# EAGLE design sapflow_v4 (EAGLE 9.5.2)
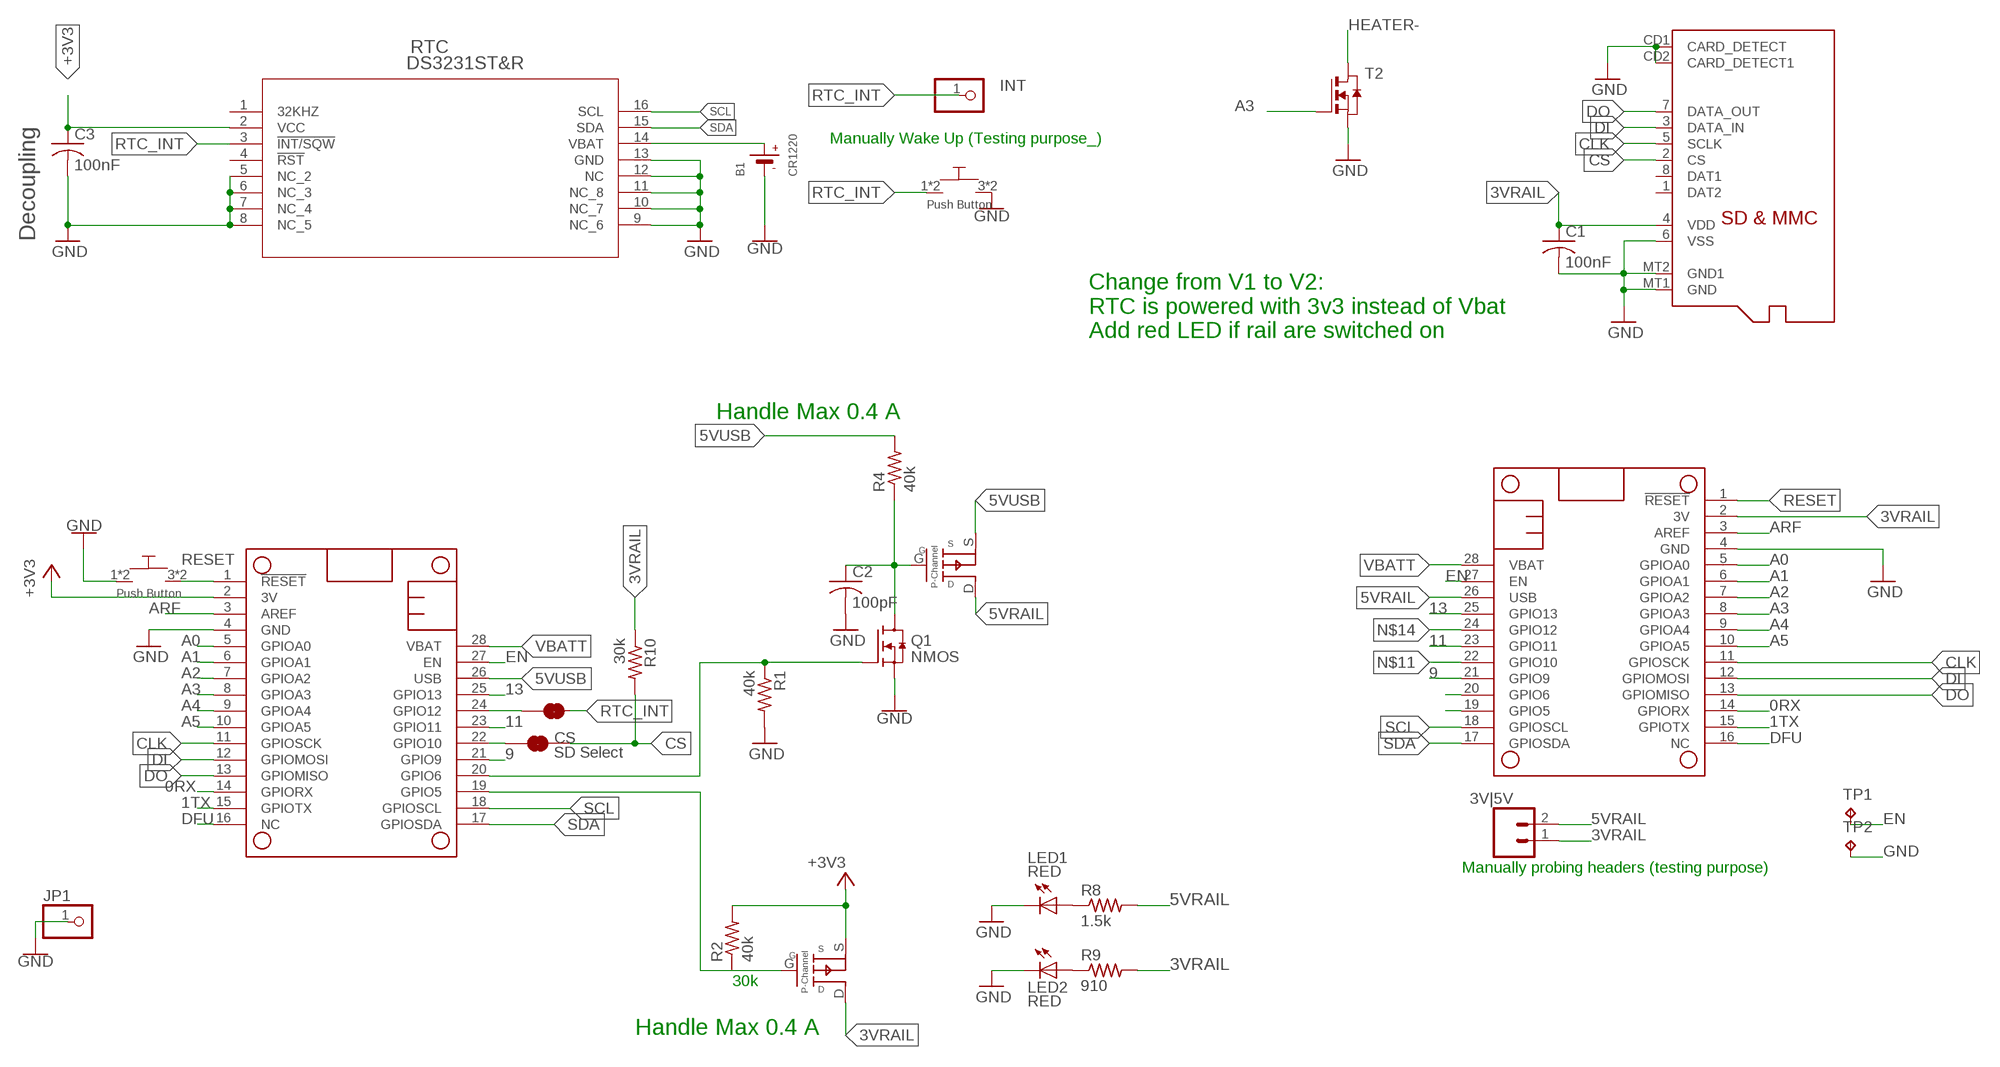
[diagram p0: schematic, sheet 1, part 1 of 2]
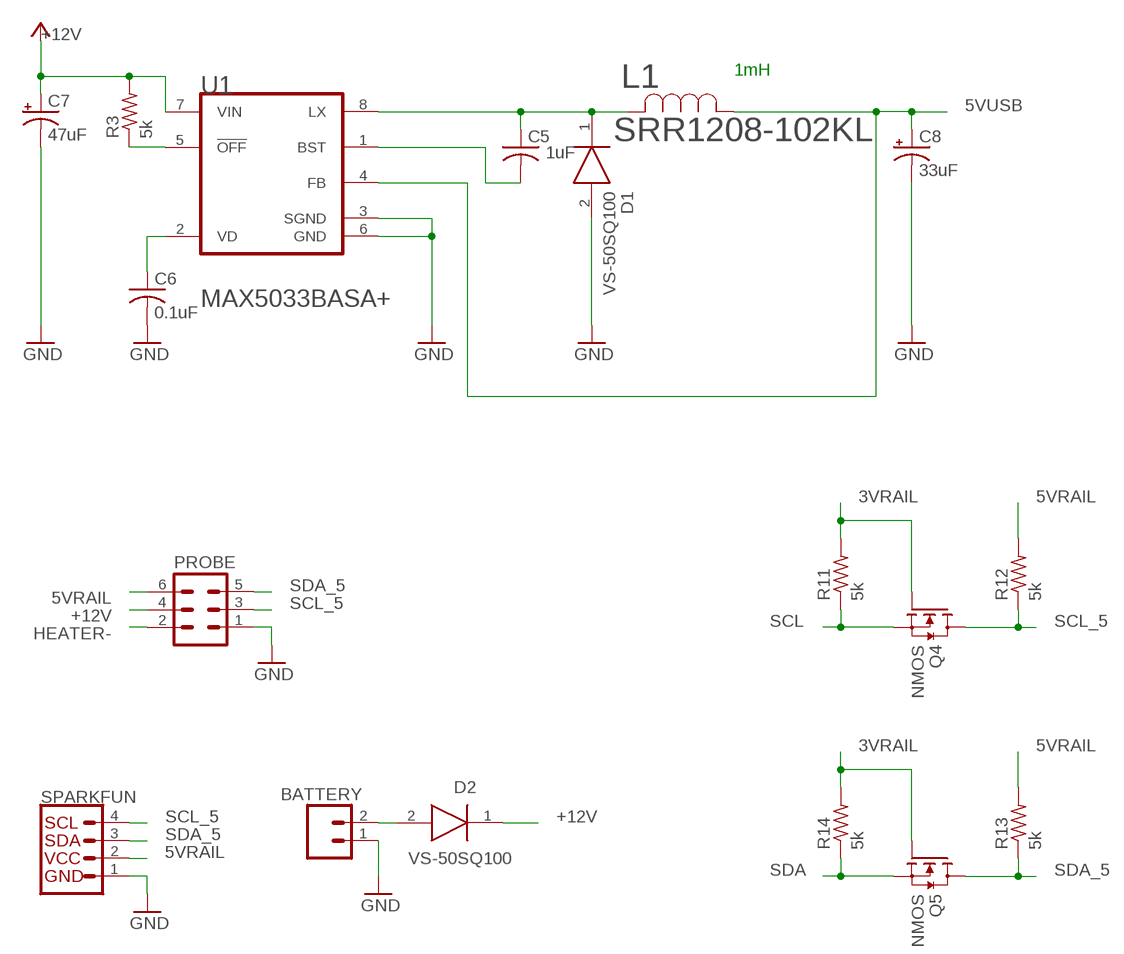
[diagram p1: schematic, sheet 1, part 2 of 2]

## Parts
3V|5V  CONN_021X02_NO_SILK  [1X02_NO_SILK]
B1  CR1220  BATTERYCR1220_SMT  [CR1220]
BATTERY  HIGHV-OUT  CONN_021X02_NO_SILK  [1X02_NO_SILK]
C1  100nF  C-USC0805  [C0805]
C2  100pF  C-USC0805  [C0805]
C3  100nF  C-USC0805  [C0805]
C5  1uF  C-USC0805  [C0805]
C6  0.1uF  C-USC0805  [C0805]
C7  47uF  CPOL-USD/7343-31R  [D/7343-31R]
C8  33uF  CPOL-USD/7343-31R  [D/7343-31R]
CS  SD Select  JUMPER-SMT_2_NC_TRACE_SILK  [SMT-JUMPER_2_NC_TRACE_SILK]
D1  VS-50SQ100  [DIOAD1405W86L465D235]
D2  VS-50SQ100  [DIOAD1405W86L465D235]
INT  PINHD-1X1CB  [1X01-CLEANBIG]
JP1  PINHD-1X1CB  [1X01-CLEANBIG]
L1  SRR1208-102KL  [IND_BOURNS_SRR1208]
LED1  RED  LEDCHIPLED_0805  [CHIPLED_0805]
LED2  RED  LEDCHIPLED_0805  [CHIPLED_0805]
MICROSD  MICROSD  [MICROSD]
MS1  FEATHERWING  [FEATHERWING]
MS2  FEATHERWING  [FEATHERWING]
PMOS1  SSM3J3228R  [SOT-23-3]
PMOS2  SSM3J3228R  [SOT-23-3]
PROBE  MA03-2  [MA03-2]
Q1  NMOS  [SOT23-S]
Q4  NMOS  [SOT23-S]
Q5  NMOS  [SOT23-S]
R1  40k  R-US_R0805  [R0805]
R2  40k  R-US_R0805  [R0805]
R3  5k  R-US_R0805  [R0805]
R4  40k  R-US_R0805  [R0805]
R8  1.5k  R-US_R0805  [R0805]
R9  910  R-US_R0805  [R0805]
R10  30k  R-US_R0805  [R0805]
R11  5k  R-US_R0805  [R0805]
R12  5k  R-US_R0805  [R0805]
R13  5k  R-US_R0805  [R0805]
R14  5k  R-US_R0805  [R0805]
RTC  DS3231ST&R  [21-0042B_16]
RTC_INT  JUMPER-SMT_2_NC_TRACE_SILK  [SMT-JUMPER_2_NC_TRACE_SILK]
SPARKFUN  I2C_STANDARD_NO_SILK  [1X04_NO_SILK]
T2  NMOSSOT223  [SOT223]
TP1  TPTP16R  [TP16R]
TP2  TPTP16R  [TP16R]
U1  MAXIM_MAX5033BASA+MAXIM_MAX5033BASA+_0_1  [MAXIM_MAX5033BASA+_1]
U$1  PUSH_BUTTON  [PUSHBUTTON_SMD]
U$2  PUSH_BUTTON  [PUSHBUTTON_SMD]

## Nets
0RX: MS1.14(GPIORX) MS2.14(GPIORX)
1TX: MS1.15(GPIOTX) MS2.15(GPIOTX)
3VRAIL: 3V|5V.1 C1.1 MICROSD.4(VDD) MS1.2(3V) PMOS2.D Q4.1(G) Q5.1(G) R9.2 R10.1 R11.2 R14.2
5VRAIL: 3V|5V.2 MS1.26(USB) PMOS1.D PROBE.6 R8.2 R12.2 R13.2 SPARKFUN.2(VCC)
5VUSB: C8.+ L1.1 MS2.26(USB) PMOS1.S R4.2 U1.4(FB)
9: MS1.21(GPIO9) MS2.21(GPIO9)
11: MS1.23(GPIO11) MS2.23(GPIO11)
13: MS1.25(GPIO13) MS2.25(GPIO13)
+3V3: C3.1 MS2.2(3V) PMOS2.S R2.2 RTC.2(VCC)
+12V: C7.+ D2.1(K) PROBE.4 R3.2 U1.7(VIN) ; supply symbol labelled 15V
A0: MS1.5(GPIOA0) MS2.5(GPIOA0)
A1: MS1.6(GPIOA1) MS2.6(GPIOA1)
A2: MS1.7(GPIOA2) MS2.7(GPIOA2)
A3: MS1.8(GPIOA3) MS2.8(GPIOA3) T2.1(G)
A4: MS1.9(GPIOA4) MS2.9(GPIOA4)
A5: MS1.10(GPIOA5) MS2.10(GPIOA5)
ARF: MS1.3(AREF) MS2.3(AREF)
CLK: MICROSD.5(SCLK) MS1.11(GPIOSCK) MS2.11(GPIOSCK)
CS: CS.2 MICROSD.2(CS) R10.2
DFU: MS1.16(NC) MS2.16(NC)
DI: MICROSD.3(DATA_IN) MS1.12(GPIOMOSI) MS2.12(GPIOMOSI)
DO: MICROSD.7(DATA_OUT) MS1.13(GPIOMISO) MS2.13(GPIOMISO)
EN: MS1.27(EN) MS2.27(EN) TP1.TP
GND [GND]: B1.- BATTERY.1 C1.2 C2.2 C3.2 C6.2 C7.- C8.- D1.2(A) JP1.1 LED1.C LED2.C MICROSD.6(VSS) MICROSD.CD1(CARD_DETECT) MICROSD.CD2(CARD_DETECT1) MICROSD.MT1(GND) MICROSD.MT2(GND1) MS1.4(GND) MS2.4(GND) PROBE.1 Q1.2(S) R1.2 RTC.5(NC_2) RTC.6(NC_3) RTC.7(NC_4) RTC.8(NC_5) RTC.9(NC_6) RTC.10(NC_7) RTC.11(NC_8) RTC.12(NC) RTC.13(GND) SPARKFUN.1(GND) T2.3(S) TP2.TP U1.3(SGND) U1.6(GND) U$1.1 U$1.2 U$2.3 U$2.4
HEATER-: PROBE.2 T2.2(D) T2.4(D)
N$1: MS2.20(GPIO6) Q1.1(G) R1.1
N$2: B1.+$1(+) RTC.14(VBAT)
N$3: MS2.19(GPIO5) PMOS2.G R2.1
N$4: BATTERY.2 D2.2(A)
N$6: C6.1 U1.2(VD)
N$7: MS1.20(GPIO6)
N$8: MS1.19(GPIO5)
N$9: R3.1 U1.5(!OFF!)
N$10: C2.1 PMOS1.G Q1.3(D) R4.1
N$11: CS.1 MS1.22(GPIO10) MS2.22(GPIO10)
N$12: LED1.A R8.1
N$13: LED2.A R9.1
N$14: MS1.24(GPIO12) MS2.24(GPIO12) RTC_INT.1
N$16: C5.2 U1.1(BST)
N$17: C5.1 D1.1(K) L1.2 U1.8(LX)
RESET: MS1.1(!RESET) MS2.1(!RESET) U$1.3 U$1.4
RTC_INT: INT.1 RTC.3(!INT/SQW) RTC_INT.2 U$2.1 U$2.2
SCL: MS1.18(GPIOSCL) MS2.18(GPIOSCL) Q4.2(S) R11.1 RTC.16(SCL)
SCL_5: PROBE.3 Q4.3(D) R12.1 SPARKFUN.4(SCL)
SDA: MS1.17(GPIOSDA) MS2.17(GPIOSDA) Q5.2(S) R14.1 RTC.15(SDA)
SDA_5: PROBE.5 Q5.3(D) R13.1 SPARKFUN.3(SDA)
VBATT: MS1.28(VBAT) MS2.28(VBAT)
Unconnected: MICROSD.1(DAT2) MICROSD.8(DAT1) RTC.1(32KHZ) RTC.4(!RST)

## Notes on the sheet
- 1mH
- Manually Wake Up (Testing purpose_)
- Decoupling
- Change from V1 to V2:
  RTC is powered with 3v3 instead of Vbat
  Add red LED if rail are switched on
- Handle Max 0.4 A
- Manually probing headers (testing purpose)
- 30k
- Handle Max 0.4 A

## Library data of the parts
3V|5V BATTERY = SparkFun-Connectors:CONN_02: Multi connection point. Often used as Generic Header-pin footprint for 0.1 inch spaced/style header connections On any of the 0.1 inch spaced packages, you can populate with these: Break Away Headers - Straight <https://www.sparkfun.com/products/116> (PRT-00116) Break Away Male Headers - Right Angle <https://www.sparkfun.com/products/553> (PRT-00553) Female Headers <https://www.sparkfun.com/products/115> (PRT-00115) Break Away Headers - Machine Pin <https://www.sparkfun.com/products/117> (PRT-00117) Break Away Female Headers - Swiss Machine Pin <https://www.sparkfun.com/products/743> (PRT-00743) For SCREWTERMINALS and SPRING TERMINALS visit here: Screw Terimnals on SparkFun.com <https://www.sparkfun.com/search/results?term=Screw+Terminals> (5mm/3.5mm/2.54mm spacing) This device is also useful as a general connection point to wire up your design to another part of your project. Our various solder wires solder well into these plated through hole pads. Hook-Up Wire - Assortment (Stranded, 22 AWG) <https://www.sparkfun.com/products/11375> (PRT-11375) Hook-Up Wire - Assortment (Solid Core, 22 AWG) <https://www.sparkfun.com/products/11367> (PRT-11367) View the entire wire category on our website here <https://www.sparkfun.com/categories/141> Special notes: Molex polarized connector foot print use with: PRT-08233 with associated crimp pins and housings. 2.54_SCREWTERM for use with PRT-10571. 3.5mm Screw Terminal footprints for PRT-08084 5mm Screw Terminal footprints for use with PRT-08432
B1 = microbuilder:BATTERY: CR1220 SMT - Digikey: 3001K-ND CD2032 BAT-HLD-001 - Digikey: BAT-HLD-001-ND
C1 C3 = adafruit:C-US: CAPACITOR, American symbol
C2 = resistor:C-US: CAPACITOR, American symbol
C5 C6 = rcl:C-US: CAPACITOR, American symbol; SPICEPREFIX: C
C7 C8 = rcl:CPOL-US: POLARIZED CAPACITOR, American symbol; SPICEPREFIX: C
CS RTC_INT = SparkFun-Jumpers:JUMPER-SMT_2_NC_TRACE: Normally closed trace jumper This jumper has a trace between two pads so it's normally closed (NC). Use a razor knife to open the connection. For best results follow the IPC guidelines for cutting traces: Cutout at least 0.063 mm (0.005 in). Remove all loose material to clean up the cut area. Seal the cut with an approved epoxy. Reapply solder to reclose the connection.
D1 D2 = VS-50SQ100:VS-50SQ100: VS-50SQ100, Schottky Diode, 5A max, 100V, 2-Pin, DO-204AR Source: Datasheet <http://docs-emea.rs-online.com/webdocs/0791/0900766b8079106c.pdf>; ALLIED_NUMBER: 70078786; ALLIED_PRICE-STOCK: http://www.alliedelec.com/vishay-pcs-vs-50sq100/70078786/; DESCRIPTION: VS-50SQ100, Schottky Diode, 5A max, 100V, 2-Pin, DO-204AR; HEIGHT: mm; MANUFACTURER_NAME: Vishay; MANUFACTURER_PART_NUMBER: VS-50SQ100; MOUSER_PART_NUMBER: 844-50SQ100; MOUSER_PRICE-STOCK: https://www.mouser.com/Search/Refine.aspx?Keyword=844-50SQ100; RS_PART_NUMBER: 5446041; RS_PRICE-STOCK: https://uk.rs-online.com/web/p/products/5446041
INT JP1 = adafruit:PINHD-1X1: Pin header 1x1 for 0.1" spacing With round pins
L1 = SRR1208-102KL:SRR1208-102KL; BUILT_BY: EMA_UL_Team; MANUFACTURER_PART_NUMBER: SRR1208-102KL; VENDOR: Bourns Electronics
LED1 LED2 = adafruit:LED: LED OSRAM: - CHIPLED LG R971, LG N971, LY N971, LG Q971, LY Q971, LO R971, LY R971 LH N974, LH R974 LS Q976, LO Q976, LY Q976 LO Q996 - Hyper CHIPLED LW Q18S LB Q993, LB Q99A, LB R99A - SideLED LS A670, LO A670, LY A670, LG A670, LP A670 LB A673, LV A673, LT A673, LW A673 LH A674 LY A675 LS A676, LA A676, LO A676, LY A676, LW A676 LS A679, LY A679, LG A679 - Hyper Micro SIDELED® LS Y876, LA Y876, LO Y876, LY Y876 LT Y87S - SmartLED LW L88C, LW L88S LB L89C, LB L89S, LG L890 LS L89K, LO L89K, LY L89K LS L896, LA L896, LO L896, LY L896 - TOPLED LS T670, LO T670, LY T670, LG T670, LP T670 LSG T670, LSP T670, LSY T670, LOP T670, LYG T670 LG T671, LOG T671, LSG T671 LB T673, LV T673, LT T673, LW T673 LH T674 LS T676, LA T676, LO T676, LY T676, LB T676, LH T676, LSB T676, LW T676 LB T67C, LV T67C, LT T67C, LS T67K, LO T67K, LY T67K, LW E67C LS E67B, LA E67B, LO E67B, LY E67B, LB E67C, LV E67C, LT E67C LW T67C LS T679, LY T679, LG T679 LS T770, LO T770, LY T770, LG T770, LP T770 LB T773, LV T773, LT T773, LW T773 LH T774 LS E675, LA E675, LY E675, LS T675 LS T776, LA T776, LO T776, LY T776, LB T776 LHGB T686 LT T68C, LB T68C - Hyper Mini TOPLED® LB M676 - Mini TOPLED Santana® LG M470 LS M47K, LO M47K, LY M47K Source: http://www.osram.convergy.de/
MICROSD = adafruit:MICROSD: Micro-SD / Transflash card holder with SPI pinout For the 3M # 2908-05WB-MG and/or 4UCON #19656 push-push type
MS1 = powerboard:FEATHERWING
MS2 = adafruit:FEATHERWING
PMOS1 PMOS2 = M0_Power:SSM3J3228R: P-Channel MOSFET, SOT-23-3 SMD Package
PROBE = better_header:MA03-2: PIN HEADER; OC_FARNELL: unknown; OC_NEWARK: unknown
Q1 Q4 Q5 = eDNA:NMOS
R1-R4 R8-R14 = rcl:R-US_: RESISTOR, American symbol; SPICEPREFIX: R
RTC = power8:DS3231ST&R: DS3231 RTC IC only; MANUFACTURER_PART_NUMBER: DS3231S#T&R; VENDOR: Maxim Integrated Products
SPARKFUN = SparkX:I2C_STANDARD: SparkFun I2C Standard Pinout Header SparkFun has standardized on a pinout for all I2C based sensor breakouts. This pinout allows I2C boards to be plugged directly into the headers on Arduino Uno compatible boards, and to be daisy chained easily. Example SparkFun Products: SparkFun Atmospheric Sensor Breakout - BME280 <https://www.sparkfun.com/products/13676> SparkFun Altitude/Pressure Sensor Breakout - MPL3115A2 <https://www.sparkfun.com/products/11084> SparkFun TOF Range Finder Sensor - VL6180 <https://www.sparkfun.com/products/12785>
T2 = zetex:NMOSSOT223: MOS FET; OC_FARNELL: unknown; OC_NEWARK: unknown
TP1 TP2 = testpad:TP: Test pad
U1 = Maxim - MAX5033BASA+:MAXIM_MAX5033BASA+: MAX-MAX5033-IL8; CIIVA_IDS: 1484514; CODE__IPC: SOIC127P600-8; CODE__JEDEC: MS-012-AA; COMPONENT_LINK_1_DESCRIPTION: Manufacturer URL; COMPONENT_LINK_1_URL: http://www.maxim-ic.com; COMPONENT_LINK_3_DESCRIPTION: Package Specification; COMPONENT_LINK_3_URL: http://pdfserv.maxim-ic.com/package_dwgs/21-0041.PDF; DATASHEET: http://datasheets.maxim-ic.com/en/ds/MAX5033.pdf; DATASHEET_VERSION: Rev 5, May-2011; FOOTPRINT_VARIANT_NAME_0: Level C; FOOTPRINT_VARIANT_NAME_1: Level B; FOOTPRINT_VARIANT_NAME_2: Level A; IMPORTED: yes; IMPORTED_FROM: vault; IMPORT_TS: 1521862065; MF: Maxim; MPN: MAX5033BASA+; PACKAGE: S8+5; PACKAGE_DESCRIPTION: 8-Pin Small-Outline IC, Narrow (0.15in), 1.27 mm Pitch, SOIC (N), Pb-Free; PACKAGE_VERSION: revC, 2010; PREFIX: U; RELEASE_DATE: 1332919945; VAULT_GUID: 1E7CABE1-80B5-44B1-A1B1-D79A0DB0D6E1; VAULT_REVISION: 223A1D72-BB07-4F7F-9695-43D469E578B1
U$1 U$2 = eDNA:PUSH_BUTTON: SMD low profile push-button NOPE https://www.mouser.com/ProductDetail/ALPS/SKTHAHE010?qs=sGAEpiMZZMsgGjVA3toVBFPD9IcV2kPoEtmOqlcDILk%3D https://www.digikey.com/product-detail/en/c-k/KMR731NG-LFS/CKN10687TR-ND/6035353 https://www.arrow.com/en/products/kmr731nglfs/ck https://www.mouser.com/ProductDetail/CK/KMR731NGLFS?qs=%2Fha2pyFaduiYmAh2YH01EjoHSsd%2F4x%252BsVgk0GVi4JwmLxfMBh2nzdw%3D%3D

## Net classes
0 default: clearance 0.205 mm
1 GND: clearance 0.205 mm to class 0, clearance 0.205 mm
2 HIGHVOLTAGE: clearance 0.205 mm to class 0, clearance 0.205 mm to class 1, clearance 0.3 mm

## Board
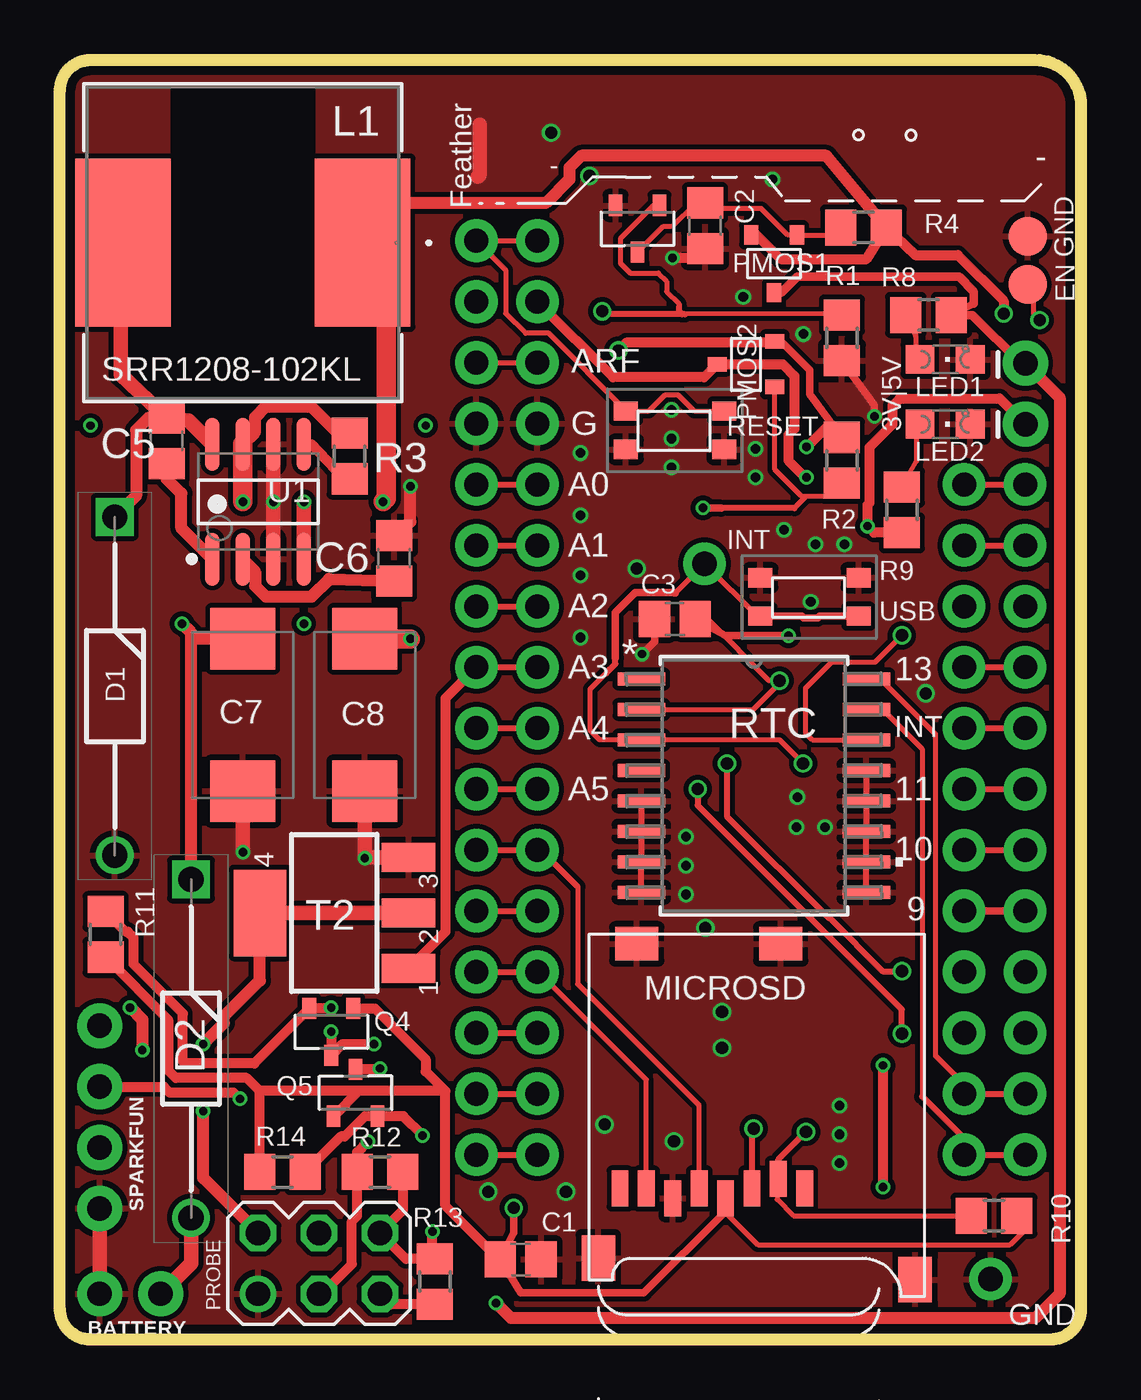
[diagram p2: board, top side]
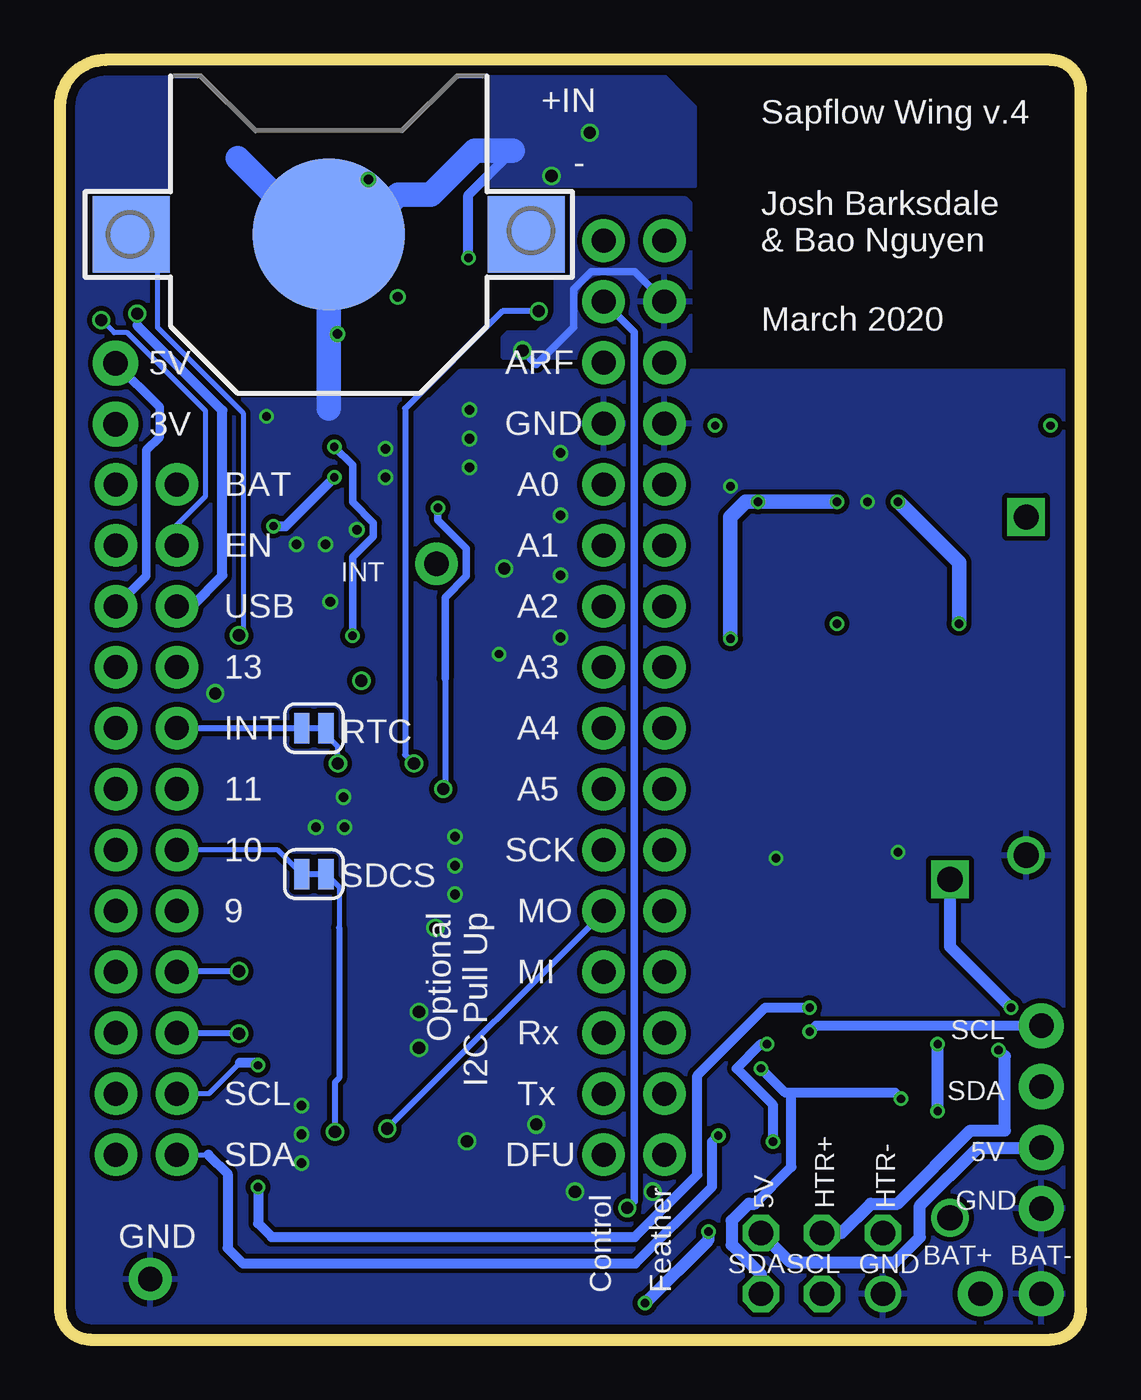
[diagram p3: board, bottom side, seen from below]

Size 42.55 x 53.34 mm. Coordinates in mm from the lower left corner, seen from the top.
Outline: 1.27,53.34 40.64,53.34 arc-90 42.55,51.44 42.55,1.27 arc-90 41.28,0 1.27,0 arc-90 0,1.27 0,52.07 arc-90 1.27,53.34
Copper layers (1*16): Top 0.035559375mm / dielectric 1.6mm / Bottom 0.035559375mm
Design rules "osh_park": minimum track width 6mil, minimum drill 10mil, track to track 6mil, track to pad 6mil, pad to pad 6mil, via to via 6mil, smd to smd 6mil, copper to edge 15mil, drill to drill 6mil, minimum pad ring 5mil, minimum via ring 5mil, stop-mask expansion 2.5mil, vias tented up to drill 0mil, thermal gap 10mil

### Footprints (pad centres in the part's own frame; a part is rotated, then mirrored left to right if it is on the bottom)
1X02_NO_SILK = drill 1.016 pad 1.88: 1 0,0; 2 2.54,0
CR1220 = smd 3.2 x 3.2: +$1 -8.225,0; +$2 8.225,0 | smd 6.35 x 6.35: - 0,0
C0805 = smd 1.3 x 1.5: 1 -0.85,0; 2 0.85,0
C0805' = smd 1.3 x 1.5: 1 -0.95,0; 2 0.95,0
D/7343-31R = smd 2.55 x 2.7: + 3.175,0; - -3.175,0
SMT-JUMPER_2_NC_TRACE_SILK = smd 0.635 x 1.27: 1 -0.508,0; 2 0.508,0
DIOAD1405W86L465D235 = drill 1.05 pad 1.575 square: 1 0,0 | drill 1.05 pad 1.575: 2 14.1,0
1X01-CLEANBIG = drill 1.016 pad 1.778: 1 0,0
IND_BOURNS_SRR1208 = smd 3.988 x 7.01: 1 -4.991,0; 2 4.991,0
CHIPLED_0805 = smd 1.2 x 1.2: A 0,-1.05; C 0,1.05
MICROSD = smd 0.7 x 1.5: 1 9,-10.64; 2 7.9,-10.24; 3 6.8,-10.64; 4 5.7,-11.04; 5 4.6,-10.64; 6 3.5,-11.04; 7 2.4,-10.64; 8 1.3,-10.64 | smd 1.8 x 1.4: CD1 2,-0.44; CD2 8,-0.44 | smd 1.4 x 1.9: MT1 0.4,-13.54; MT2 13.6,-14.44
FEATHERWING = drill 1 pad 1.778: 1 6.35,1.27; 2 8.89,1.27; 3 11.43,1.27; 4 13.97,1.27; 5 16.51,1.27; 6 19.05,1.27; 7 21.59,1.27; 8 24.13,1.27; 9 26.67,1.27; 10 29.21,1.27; 11 31.75,1.27; 12 34.29,1.27; 13 36.83,1.27; 14 39.37,1.27; 15 41.91,1.27; 16 44.45,1.27; 17 44.45,21.59; 18 41.91,21.59; 19 39.37,21.59; 20 36.83,21.59; 21 34.29,21.59; 22 31.75,21.59; 23 29.21,21.59; 24 26.67,21.59; 25 24.13,21.59; 26 21.59,21.59; 27 19.05,21.59; 28 16.51,21.59
SOT-23-3 = smd 0.8 x 0.6: D 1.2,0; G -1.2,0.95; S -1.2,-0.95
MA03-2 = drill 1.016: 1 -2.54,-1.27 | drill 1.016 octagon: 2 -2.54,1.27; 3 0,-1.27; 4 0,1.27; 5 2.54,-1.27; 6 2.54,1.27
SOT23-S = smd 0.88 x 0.569: 1 -0.975,0.915; 2 -0.975,-0.915; 3 0.975,0
R0805 = smd 1.3 x 1.5: 1 -0.95,0; 2 0.95,0
21-0042B_16 = smd 1.981 x 0.533: 1 -4.686,4.445; 2 -4.686,3.175; 3 -4.686,1.905; 4 -4.686,0.635; 5 -4.686,-0.635; 6 -4.686,-1.905; 7 -4.686,-3.175; 8 -4.686,-4.445; 9 4.686,-4.445; 10 4.686,-3.175; 11 4.686,-1.905; 12 4.686,-0.635; 13 4.686,0.635; 14 4.686,1.905; 15 4.686,3.175; 16 4.686,4.445
1X04_NO_SILK = drill 1.016 pad 1.88: 1 0,0; 2 2.54,0; 3 5.08,0; 4 7.62,0
SOT223 = smd 1.219 x 2.235: 1 -2.311,-3.099; 2 0,-3.099; 3 2.311,-3.099 | smd 3.6 x 2.2: 4 0,3.099
TP16R = smd 1.6 x 1.6: TP 0,0
MAXIM_MAX5033BASA+_1 = smd 2.2 x 0.6: 1 -2.4,1.905; 2 -2.4,0.635; 3 -2.4,-0.635; 4 -2.4,-1.905; 5 2.4,-1.905; 6 2.4,-0.635; 7 2.4,0.635; 8 2.4,1.905
PUSHBUTTON_SMD = smd 1 x 0.8: 1 0,-1.6; 2 4.1,-1.6; 3 0,0; 4 4.1,0

### Placement (x,y rotation side)
3V|5V  40.23,38.16 90 bottom
B1  31.34,46.07 0 bottom
BATTERY  1.65,1.91 0 top
C1  19.2,3.34 0 top
C2  100pF  [C0805']  26.88,46.43 270 top
C3  25.62,30.04 180 top
C5  1uF  [C0805']  4.45,37.47 270 top
C6  0.1uF  [C0805']  13.92,32.56 90 top
C7  7.62,26.04 90 top
C8  12.7,26.04 90 top
CS  31.97,19.4 0 bottom
D1  2.29,34.29 270 top
D2  5.46,19.18 270 top
INT  26.86,32.34 0 top
JP1  38.78,2.52 0 top
L1  7.62,45.72 180 top
LED1  36.88,40.86 270 top
LED2  36.88,38.16 270 top
MICROSD  22.04,16.93 0 top
MS1  18.62,52.16 270 top
MS2  16.09,52.16 270 top
PMOS1  29.76,44.85 270 top
PMOS2  28.59,40.66 180 top
PROBE  10.8,3.17 0 top
Q1  24.07,46.3 270 top
Q4  11.3,12.83 270 top
Q5  12.32,10.29 90 top
R1  32.59,41.76 270 top
R2  32.59,36.66 90 top
R3  12.07,36.83 90 top
R4  33.48,46.36 0 top
R8  36.2,42.71 0 top
R9  35.09,34.59 270 top
R10  38.93,5.17 180 top
R11  1.91,16.89 270 top
R12  13.34,6.99 0 top
R13  15.62,2.41 90 top
R14  9.27,6.99 180 top
RTC  28.92,23.09 0 top
RTC_INT  31.97,25.48 0 bottom
SPARKFUN  1.65,5.46 90 top
T2  11.43,17.78 90 top
TP1  40.33,43.98 0 top
TP2  40.33,45.98 0 top
U1  8.26,34.93 90 top
U$1  23.59,38.71 0 top
U$2  29.19,31.75 0 top

### Tracks (layer width: path | path; a pad name or v marks a point on that pad's centre or on a via)
0RX
  Top 0.254: MS2.14 MS1.14
1TX
  Top 0.254: MS2.15 MS1.15
3VRAIL  (via drill 0.35, 0.51)
  Top 0.203: MICROSD.4 27.68,5.84 27.68,5.35 29.08,3.95 39.59,3.95 40.35,4.71 R10.1
  Top 0.254: MICROSD.4 27.72,5.92 27.72,5.33
  Top 0.305: 27.72,5.33 24.33,1.94 19.2,1.94 C1.1 18.91,4.45 v18.91,5.49 | 33.86,37.32 33.89,37.35
  Top 0.406: 3V|5V.1 39.16,39.23 34.99,39.23 34.7,38.94 34.7,38.16 33.89,37.35 33.74,37.2 33.74,34.89 33.66,34.8 v33.66,33.91 33.93,33.64 R9.2 | MS1.2 23.05,40.11 26.84,40.11 PMOS2.D 30.12,40.66 30.61,40.17 30.61,37.97 30.35,37.72 30.35,36.65 31.06,35.94 v31.12,35.94 | C1.1 17.8,3.83 16.06,5.57 16.06,10.36 | R11.2 4.51,13.34 4.51,11.22 4.83,10.9 7.78,10.9 8.32,10.36 | 16.06,10.36 12.45,10.36 | 12.45,10.36 Q5.1 | Q4.1 13.12,13.8 15.24,11.68 15.24,11.18 16.06,10.36 | 12.45,10.36 8.32,10.36 | 8.32,10.36 R14.2
  Bottom 0.305: MS1.2 18.62,41.99 18.62,5.77 v18.91,5.49
  Bottom 0.406: v33.66,33.91 33.15,33.91 v31.12,35.94
5VRAIL  (via drill 0.35)
  Top 0.305: 38.09,43.17 R8.2 | PMOS1.D 30.06,43.65
  Top 0.355: 38.09,43.17 38.09,43.69 37.47,44.3 30.72,44.3 30.06,43.65 | 3V|5V.2 40.03,40.7 38.02,42.71 R8.2
  Top 0.406: R12.2 14.29,5.4 PROBE.6 14.42,3.36 R13.2 15.52,3.46 v15.52,4.5
  Top 0.508: 3V|5V.2 41.66,39.27 41.66,1.91 40.64,0.89 18.8,0.89 v18.16,1.52
  Bottom 0.355: 3V|5V.2 38.4,38.86 38.4,37.62 38.95,37.07 38.95,31.83 MS1.26
  Bottom 0.508: PROBE.6 12.11,3.22 7.75,3.22 6.71,4.27 6.71,5.59 4.3,8 SPARKFUN.2 | v18.16,1.52 15.52,4.17 v15.52,4.5
5VUSB  (via drill 0.35, 0.51)
  Top 0.406: v39.33,42.77 39.33,43.3 37.42,45.21 35.63,45.21 R4.2 33.61,45.04 30.04,45.04 29.03,46.05 PMOS1.S
  Top 0.508: L1.1 14.26,47.37 20.23,47.37 21.23,48.36 21.23,48.85 21.72,49.35 31.94,49.35 R4.2
  Top 0.61: U1.4 v10.16,34.93
  Top 0.813: L1.1 13.59,44.74 13.59,35.05 v13.46,34.93 | C8.+ v14.61,29.21
  Bottom 0.305: 39.33,42.28 v39.33,42.77
  Bottom 0.406: MS2.26 37.06,30.57 35.78,31.85 35.78,38.73 39.33,42.28
  Bottom 0.61: v14.61,29.21 14.61,34.29 13.97,34.93 v13.46,34.93 v10.16,34.93
9
  Top 0.305: MS2.21 MS1.21
11
  Top 0.254: MS2.23 MS1.23
13
  Top 0.254: MS2.25 MS1.25
+3V3  (via drill 0.35, 0.51)
  Top 0.203: C3.1 27.02,29.98 29.55,27.46 v29.98,27.46 29.98,27.36 28.88,26.26 RTC.2
  Top 0.305: 29.73,41.55 PMOS2.S 30.06,41.61 31.25,40.41 31.25,39.41 R2.2 | C3.1 27.72,29.34 v30.35,29.34
  Top 0.406: 29.73,41.55 23.59,41.55 v23.27,41.23 | v31.12,37.21 32,38.1 R2.2
  Bottom 0.305: v23.27,41.23 22.69,40.65 21.14,42.2 21.14,43.78 20.41,44.51 18.6,44.51 MS2.2 | v31.12,37.21 30.35,36.45 30.35,34.9 29.49,34.04 29.49,33.47 30.35,32.61 v30.35,29.34
  pour Bottom: 16.29,40.96 16.29,47.36 16.48,47.55 21.89,47.55 21.89,42.76 22.69,41.96 23.89,41.96 24.09,41.76 24.09,40.96
+12V  (via drill 0.35)
  Top 0.508: C7.+ 5.72,29.21 v5.08,29.85 5.46,29.46 5.46,29.34 D2.1 | U1.7 8.13,37.84 8.13,38.44 8.58,38.88 10.47,38.88 11.68,37.68 R3.2 | v2.92,13.84 3.43,13.34 v3.43,12.07
  Top 0.813: U1.7 v7.62,34.93
  Bottom 0.508: D2.1 5.46,16.38 v2.92,13.84 | PROBE.4 9.98,4.45 8.76,5.67 7.64,5.67 4.6,8.71 3.18,8.71 3.18,11.81 v3.43,12.07
  Bottom 0.61: v5.08,29.85 5.08,32.39 v7.62,34.93
A0
  Top 0.254: MS2.5 MS1.5
A1
  Top 0.254: MS2.6 MS1.6
A2
  Top 0.254: MS2.7 MS1.7
A3
  Top 0.254: MS2.8 MS1.8
  Top 0.406: MS2.8 16.06,26.73 16.06,17 T2.1
A4
  Top 0.254: MS2.9 MS1.9
A5
  Top 0.254: MS2.10 MS1.10
ARF
  Top 0.203: MS2.3 MS1.3
CLK
  Top 0.203: MICROSD.5 26.63,9.75 21.57,14.82 21.57,18.87
  Top 0.254: 21.57,18.87 20.04,20.4 MS1.11 MS2.11
CS  (via drill 0.51)
  Top 0.203: MICROSD.2 29.88,6.64 29.88,5.84 30.56,5.17 R10.2
  Top 0.254: v31.09,8.66 29.94,7.5 MICROSD.2
  Bottom 0.203: CS.2 30.91,18.86 30.91,17.18
  Bottom 0.254: v31.09,8.66 31.09,10.73 30.91,10.91 30.91,17.18
DFU
  Top 0.254: MS2.16 MS1.16
DI  (via drill 0.51)
  Top 0.254: v28.91,8.8 28.84,8.73 MICROSD.3 | MS2.12 MS1.12
  Bottom 0.254: v28.91,8.8 19.9,17.8 MS1.12
DO
  Top 0.203: MS1.13 19.94,15.32 | MICROSD.7 24.44,10.82 20.09,15.16
  Top 0.254: MS2.13 19.94,15.32 20.09,15.16
EN  (via drill 0.51)
  Top 0.203: v40.82,42.5 40.57,42.75 40.57,43.49 40.29,43.77 40.29,43.98 TP1.TP
  Top 0.254: MS2.27 MS1.27
  Bottom 0.203: v40.82,42.5 40.29,41.97 39.74,41.97 36.48,38.7 36.48,35.15 37.68,33.96 MS2.27
GND  (via drill 0.35, 0.4, 0.51)
  Top 0.254: RTC.8 RTC.7 RTC.6 RTC.5 | RTC.9 RTC.10 RTC.11 RTC.12 RTC.13
  Top 0.305: R1.2 33.93,38.96 v33.93,38.48 | C3.2 24.77,29.09 v24.26,28.57
  Top 0.406: C2.2 26.49,45.09 v25.53,45.09
  Top 0.508: C6.2 14.61,34.09 v14.61,35.56
  Top 0.61: C7.- v7.62,20.32 | C8.- v12.7,20.07 12.73,20.09 T2.3 | 17.41,48.47 17.49,48.56 17.49,49.66 17.49,50.64 | U1.6 v8.89,34.93 U1.3 | BATTERY.1 SPARKFUN.1
  Bottom 0.406: v25.53,45.09 25.53,47.71 23.69,49.55
  Bottom 0.813: 30.09,47.32 B1.- 31.95,46.07
  Bottom 1.016: B1.- 31.34,38.82 | 30.09,47.32 29.24,47.32 29.05,47.12 28.45,47.72 27.1,47.72 25.26,49.55 23.69,49.55 | 35.13,49.26 31.95,46.07
  other vias: 25.59,8.27 30.73,22.61 30.18,33.76 26.9,17.15 20.47,50.3 36.08,26.93 22.7,8.96 27.59,13.65 21.09,6.16 17.85,6.16 24.04,32.14 27.59,12.16 28.98,37.12 28.98,35.95 28.47,43.46 25.48,38.76 25.48,37.55 25.48,36.36 30.69,21.36 31.88,21.36 31.48,33.16 32.69,33.16 31.29,30.75 26.09,20.95 26.09,19.75 26.09,18.55 32.48,9.75 32.48,8.55 32.48,7.35 30.98,41.92 22.07,48.51 29.69,48.36 21.69,34.36 21.69,36.96 21.69,31.86 21.69,29.26
  pour Top: 0.35,53.16 42.09,53.16 42.09,0.16 0.35,0.16
  pour Bottom: 0.11,40.36 25.88,40.36 27.09,39.16 35.09,39.16 38.09,42.16 38.09,52.66 42.09,52.66 42.09,0.16 0.11,0.16
  pour Bottom: 16.09,48.12 16.09,51.36 17.89,53.16 24.48,53.16 24.69,52.96 24.69,48.16 24.65,48.12
HEATER-  (via drill 0.35)
  Top 0.508: PROBE.2 5.97,6.73 v5.97,9.52 | v5.97,12.32 6.83,13.18 6.83,13.47 8.33,14.97 T2.4
  Top 0.61: T2.4 T2.2
  Bottom 0.508: v5.97,9.52 v5.97,12.32
N$1  (via drill 0.51)
  Top 0.203: R1.1 32.59,43.17 32.18,42.76 26.04,42.74 25.92,42.74 | 25.8,43.05 25.8,43.17 25.28,43.69 25.28,44.11 24.94,44.45 23.76,44.45 23.35,44.86 23.35,45.89 24.73,47.28 Q1.1
  Top 0.254: v35.09,15.36 34.29,15.36 32.07,17.57 32.04,17.57 27.8,21.81 v27.8,24.02 | 25.92,42.74 25.8,42.87 25.8,43.05 | v22.6,42.86 22.72,42.74 26.04,42.74
  Bottom 0.254: v22.6,42.86 24.11,42.86 28.16,38.81 28.16,24.38 v27.8,24.02 | v35.09,15.36 37.65,15.36 MS2.20
N$2  (via drill 0.51)
  Top 0.203: RTC.14 31.36,24.99 31.06,25.29 31.06,27.14 32.15,28.23 33.96,28.23 v35.09,29.36
  Bottom 0.203: v35.09,29.36 34.91,29.53 34.91,38.62 38.49,42.2 38.49,44.98 B1.+$1
N$3  (via drill 0.35, 0.51)
  Top 0.203: 31.11,35.16 30.9,35.16 29.79,36.27 PMOS2.G | 31.11,35.16 32.51,35.16 R2.1 | 30.61,34.66 31.11,35.16
  Top 0.254: v35.09,12.75 35.09,13.75 26.58,22.27 v26.58,22.95 | 30.61,34.66 27.55,34.66
  Top 0.305: 27.55,34.66 26.81,34.66 v26.8,34.67
  Bottom 0.254: 26.49,27.56 26.49,23.04 v26.58,22.95 | v35.09,12.75 37.65,12.75 MS2.19
  Bottom 0.305: 26.49,27.56 26.49,30.93 25.61,31.82 25.61,32.98 26.8,34.16 v26.8,34.67
N$4
  Top 0.61: BATTERY.2 5.46,3.17 D2.2
N$6
  Top 0.508: U1.2 8.13,32.01 8.13,31.41 8.58,30.97 10.47,30.97 11.21,31.71 C6.1
N$9
  Top 0.406: U1.5 10.48,37.33 11.82,35.88 R3.1
N$10
  Top 0.203: R4.1 32.18,46.05 PMOS1.G 30.34,46.05 29.23,47.15 27.12,47.15 26.9,47.37 | 26.9,47.37 C2.1 | Q1.3 25.14,46.4 25.52,46.4 26.48,47.37 26.9,47.37
N$11
  Top 0.254: MS2.22 MS1.22
  Bottom 0.203: CS.1 33.47,20.4 MS2.22
N$12
  Top 0.203: LED1.A 35.66,41.03 35.66,41.82 R8.1
N$13
  Top 0.203: R9.1 35.69,36.61 35.69,38.01 LED2.A
N$14
  Top 0.254: MS2.24 MS1.24
  Bottom 0.254: MS2.24 RTC_INT.1
N$16
  Top 0.508: U1.1 5.06,33.82 5.06,35.27 4.45,35.88 C5.2
N$17
  Top 0.508: C5.1 3.68,38.42 3.18,37.91 3.18,35.18 D1.1
  Top 0.61: U1.8 5.36,38.32 C5.1 2.54,40.22 2.54,45.63 L1.2
N$19  (via drill 0.35)
  other vias: 10.16,29.85
N$20  (via drill 0.35)
  other vias: 1.27,38.1
N$21  (via drill 0.35)
  other vias: 15.24,38.1
RESET
  Top 0.203: MS1.1 MS2.1 18.57,44.59 18.57,42.77 19.4,41.94 20.37,41.94 23.59,38.73 U$1.3 24.54,38.71 25.22,39.39 25.75,39.39 26.43,38.71 U$1.4
RTC_INT  (via drill 0.51)
  Top 0.203: v30.97,24.02 29.99,24.99 RTC.3 22.49,24.99 22.09,25.39 22.09,27.11 22.76,27.78 | U$2.1 29.06,30.15 27.98,31.24 27.95,31.24 INT.1 25.64,31.12
  Top 0.254: 22.76,27.78 22.91,27.93 22.91,27.94 23.14,28.17 23.14,28.41
  Top 0.305: U$2.1 30.92,30.15 31,30.07 31.57,30.07 31.65,30.15 U$2.2 | 25.64,31.12 25.59,31.12 25.57,31.14 23.98,31.14 23.14,30.3 23.14,28.41
  Bottom 0.203: RTC_INT.2 31.46,25.2 30.97,24.71 v30.97,24.02
SCL  (via drill 0.35)
  Top 0.203: RTC.16 33.66,27.47 34.25,27.47 36.48,25.25 36.48,11.84 37.47,10.85
  Top 0.254: MS1.18 MS2.18 37.68,10.64 37.47,10.85
  Top 0.406: v34.29,11.43 v34.29,6.35 | R11.1 2.75,17 2.82,17 3.06,16.76 3.06,15.65 5.12,13.59 5.12,11.59 5.21,11.51 8.1,11.51 Q4.2 11.26,13.8 v11.3,13.84
  Bottom 0.203: 35.04,11.54 36.34,10.25 MS2.18
  Bottom 0.406: 35.04,11.54 34.4,11.54 v34.29,11.43 | v34.29,6.35 34.29,4.83 33.73,4.27 18.59,4.27 15.99,6.87 15.99,11.01 13.15,13.84 v11.3,13.84
SCL_5  (via drill 0.35)
  Top 0.406: PROBE.3 10.93,1.91 12.17,3.14 12.17,4.93 12.39,5.15 R12.1 12.39,7.81 v12.83,8.25 | v11.3,12.83 Q4.3 11.77,12.32 v13.08,12.32
  Bottom 0.406: v11.3,12.83 11.05,13.08 SPARKFUN.4 | v12.83,8.25 12.83,9.78 14.35,11.3 13.34,12.32 v13.08,12.32
SDA  (via drill 0.35)
  Top 0.203: RTC.15 34.29,26.26 35.93,24.62 35.93,10.13
  Top 0.254: MS1.17 MS2.17 37.68,8.38 35.93,10.13
  Top 0.406: v15.11,8.51 14.31,9.31 Q5.2 12.71,9.31 11.86,8.46 11.7,8.46 R14.1
  Bottom 0.203: MS2.17 36.36,7.71
  Bottom 0.406: 36.36,7.71 35.56,6.91 35.56,3.81 34.93,3.17 18.57,3.17 15.37,6.37 15.37,8.25 v15.11,8.51
SDA_5  (via drill 0.35)
  Top 0.406: R13.1 13.78,1.46 PROBE.5 | SPARKFUN.3 4.32,10.54 4.58,10.29 7.24,10.29 v7.49,10.03 | v13.34,11.3 13.29,11.26 Q5.3
  Bottom 0.406: v7.49,10.03 7.75,10.29 12.07,10.29 | 12.07,10.29 12.32,10.29 v13.34,11.3 | 13.59,5.67 12.07,7.19 12.07,10.29
  Bottom 0.508: 13.59,5.67 13.84,5.67 14.56,4.95 14.56,3.94 13.34,2.72 PROBE.5
VBATT
  Top 0.254: MS2.28 MS1.28

### Text on the board
tPlace: - | - | Feather | GND | EN | ARF | RESET | G | A0 | A1 | A2 | A3 | A4 | A5 | GND
bPlace: +IN | - | ARF | 5V | GND | 3V | A0 | BAT | A1 | EN | INT | A2 | USB | A3 | 13 | RTC | A4 | INT | A5 | 11 | SCK | SDCS | 10 | MO | Optional / I2C Pull Up | 9 | MI | Rx | Tx | SCL | DFU | SDA | GND | Feather | Control
tNames: USB | 13 | INT | 11 | 10 | 9
bNames: Sapflow Wing v.4 | Josh Barksdale / & Bao Nguyen | March 2020 | SCL | SDA | 5V | GND | HTR- | HTR+ | 5V | BAT- | BAT+ | SCL | SDA | GND